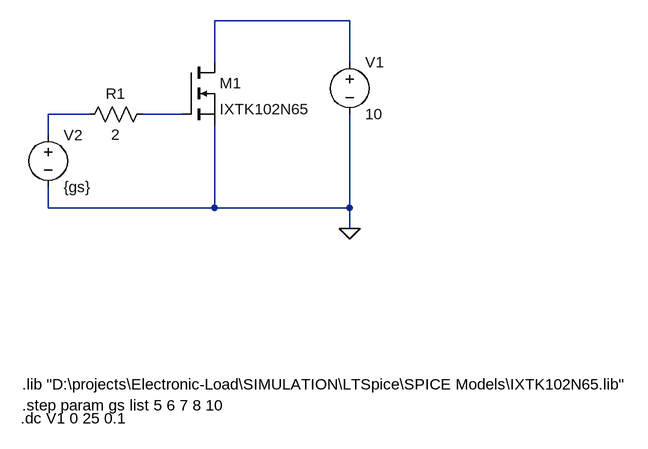
[diagram p0: schematic IXTK102N65 test.asc]
IXTK102N65 test.asc, the LTspice schematic file:
Version 4
SHEET 1 1028 680
WIRE 560 -288 352 -288
WIRE 352 -224 352 -288
WIRE 560 -224 560 -288
WIRE 160 -144 96 -144
WIRE 304 -144 240 -144
WIRE 96 -112 96 -144
WIRE 96 0 96 -32
WIRE 352 0 352 -128
WIRE 352 0 96 0
WIRE 560 0 560 -144
WIRE 560 0 352 0
WIRE 560 32 560 0
FLAG 560 32 0
SYMBOL nmos 304 -224 R0
SYMATTR InstName M1
SYMATTR Value IXTK102N65
SYMBOL voltage 560 -240 R0
WINDOW 123 0 0 Left 0
WINDOW 39 0 0 Left 0
SYMATTR InstName V1
SYMATTR Value 10
SYMBOL res 256 -160 R90
WINDOW 0 0 56 VBottom 2
WINDOW 3 32 56 VTop 2
SYMATTR InstName R1
SYMATTR Value 2
SYMBOL voltage 96 -128 R0
WINDOW 123 0 0 Left 0
WINDOW 39 0 0 Left 0
SYMATTR InstName V2
SYMATTR Value {gs}
TEXT 56 272 Left 2 !.lib "D:\\projects\\Electronic-Load\\SIMULATION\\LTSpice\\SPICE Models\\IXTK102N65.lib"
TEXT 56 304 Left 2 !.step param gs list 5 6 7 8 10
TEXT 54 324 Left 2 !.dc V1 0 25 0.1

The netlist it stands for:
* IXTK102N65 test.asc
M1 N001 N003 0 0 IXTK102N65
V1 N001 0 10
R1 N003 N002 2
V2 N002 0 {gs}
.model NMOS NMOS
.model PMOS PMOS
.lib standard.mos
.lib "D:\projects\Electronic-Load\SIMULATION\LTSpice\SPICE Models\IXTK102N65.lib"
.step param gs list 5 6 7 8 10
.dc V1 0 25 0.1
.backanno
.end